# EAGLE schematic carte suiveur (EAGLE 5.12)
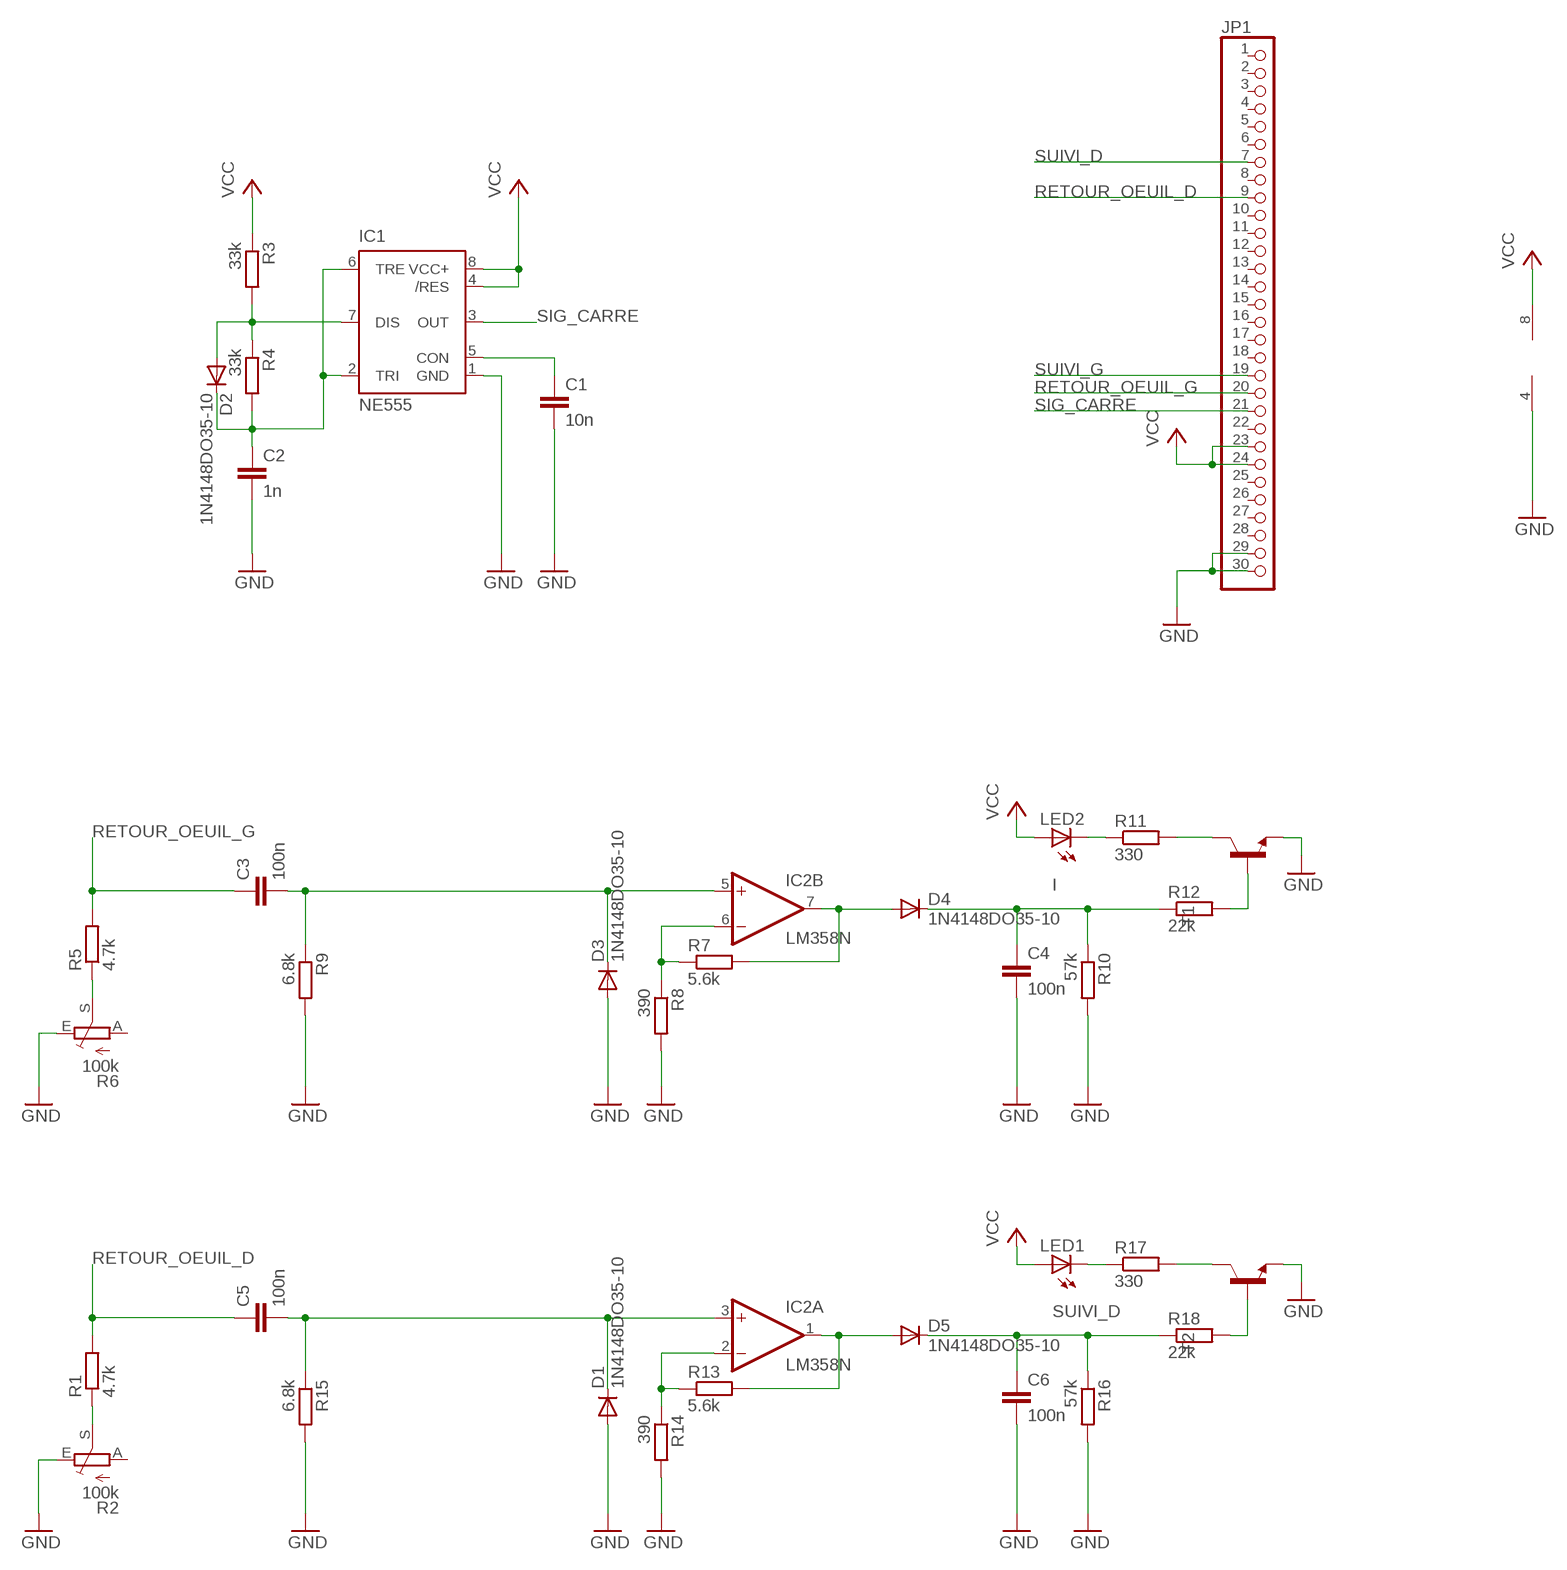
[diagram p0: schematic, sheet 1]

## Parts
C1  10n  C-EU050-025X075  [C050-025X075]
C2  1n  C-EU102-043X133  [C102-043X133]
C3  100n  C-EU050-025X075  [C050-025X075]
C4  100n  C-EU050-025X075  [C050-025X075]
C5  100n  C-EU050-025X075  [C050-025X075]
C6  100n  C-EU050-025X075  [C050-025X075]
D1  1N4148DO35-10  [DO35-10]
D2  1N4148DO35-10  [DO35-10]
D3  1N4148DO35-10  [DO35-10]
D4  1N4148DO35-10  [DO35-10]
D5  1N4148DO35-10  [DO35-10]
IC1  NE555  [DIL-08]
IC2  LM358N  [DIL08]
JP1  PINHD-1X30  [1X30]
LED1  LED3MM  [LED3MM]
LED2  LED3MM  [LED3MM]
R1  4.7k  R-EU_0207/10  [0207/10]
R2  100k  TRIM_EU-CA9V  [CA9V]
R3  33k  R-EU_0207/10  [0207/10]
R4  33k  R-EU_0207/10  [0207/10]
R5  4.7k  R-EU_0207/10  [0207/10]
R6  100k  TRIM_EU-CA9V  [CA9V]
R7  5.6k  R-EU_0207/10  [0207/10]
R8  390  R-EU_0207/12  [0207/12]
R9  6.8k  R-EU_0207/10  [0207/10]
R10  57k  R-EU_0207/10  [0207/10]
R11  330  R-EU_0207/10  [0207/10]
R12  22k  R-EU_0207/10  [0207/10]
R13  5.6k  R-EU_0207/10  [0207/10]
R14  390  R-EU_0207/10  [0207/10]
R15  6.8k  R-EU_0207/10  [0207/10]
R16  57k  R-EU_0207/10  [0207/10]
R17  330  R-EU_0207/10  [0207/10]
R18  22k  R-EU_0207/10  [0207/10]
T1  2N2222-NPN-TO92-EBC  [TO92-EBC]
T2  2N2222-NPN-TO92-EBC  [TO92-EBC]

## Nets
GND: C1.2 C2.2 C4.2 C6.2 D1.A D3.A IC1.1(GND) IC2.4(P:V-) JP1.29 JP1.30 R2.E R6.E R8.2 R9.2 R10.2 R14.2 R15.2 R16.2 T1.E T2.E
I: C4.1 D4.C R10.1 R12.1
N$1: LED1.K(C) R17.1
N$2: D2.A IC1.7(DIS) R3.2 R4.1
N$3: C2.1 D2.C IC1.2(TRI) IC1.6(TRE) R4.2
N$4: C1.1 IC1.5(CON)
N$5: C5.2 D1.C IC2.3(A:+IN) R15.1
N$6: IC2.2(A:-IN) R13.1 R14.1
N$7: C3.2 D3.C IC2.5(B:+IN) R9.1
N$8: IC2.6(B:-IN) R7.1 R8.1
N$9: D4.A IC2.7(B:OUT) R7.2
N$10: R5.1 R6.S
N$12: D5.A IC2.1(A:OUT) R13.2
N$13: R1.1 R2.S
N$14: R11.2 T1.C
N$16: R17.2 T2.C
N$17: LED2.K(C) R11.1
N$18: R18.2 T2.B
N$19: R12.2 T1.B
RETOUR_OEUIL_D: C5.1 JP1.9 R1.2
RETOUR_OEUIL_G: C3.1 JP1.20 R5.2
SIG_CARRE: IC1.3(OUT) JP1.21
SUIVI_D: C6.1 D5.C JP1.7 R16.1 R18.1
SUIVI_G: JP1.19
VCC: IC1.4(/RES) IC1.8(VCC+) IC2.8(P:V+) JP1.23 JP1.24 LED1.A LED2.A R3.1
Unconnected: JP1.1 JP1.2 JP1.3 JP1.4 JP1.5 JP1.6 JP1.8 JP1.10 JP1.11 JP1.12 JP1.13 JP1.14 JP1.15 JP1.16 JP1.17 JP1.18 JP1.22 JP1.25 JP1.26 JP1.27 JP1.28 R2.A R6.A

## Library data of the parts
C1-C6 = resistor:C-EU: CAPACITOR, European symbol
D1-D5 = diode:1N4148: DIODE high speed (Philips)
IC1 = st-microelectronics:NE555: General purpose bipolar Timer; MF: Arrow Electronics; MPN: NE555N; OC_FARNELL: 1467742; OC_NEWARK: 89K1486
IC2 = linear:LM358: OP AMP also LM158; LM258; LM2904 Source: http://cache.national.com/ds/LM/LM158.pdf
JP1 = pinhead:PINHD-1X30: PIN HEADER
LED1 LED2 = led:LED: LED OSRAM: - CHIPLED LG R971, LG N971, LY N971, LG Q971, LY Q971, LO R971, LY R971 LH N974, LH R974 LS Q976, LO Q976, LY Q976 LO Q996 - Hyper CHIPLED LW Q18S LB Q993, LB Q99A, LB R99A - SideLED LS A670, LO A670, LY A670, LG A670, LP A670 LB A673, LV A673, LT A673, LW A673 LH A674 LY A675 LS A676, LA A676, LO A676, LY A676, LW A676 LS A679, LY A679, LG A679 - Hyper Micro SIDELED® LS Y876, LA Y876, LO Y876, LY Y876 LT Y87S - SmartLED LW L88C, LW L88S LB L89C, LB L89S, LG L890 LS L89K, LO L89K, LY L89K LS L896, LA L896, LO L896, LY L896 - TOPLED LS T670, LO T670, LY T670, LG T670, LP T670 LSG T670, LSP T670, LSY T670, LOP T670, LYG T670 LG T671, LOG T671, LSG T671 LB T673, LV T673, LT T673, LW T673 LH T674 LS T676, LA T676, LO T676, LY T676, LB T676, LH T676, LSB T676, LW T676 LB T67C, LV T67C, LT T67C, LS T67K, LO T67K, LY T67K, LW E67C LS E67B, LA E67B, LO E67B, LY E67B, LB E67C, LV E67C, LT E67C LW T67C LS T679, LY T679, LG T679 LS T770, LO T770, LY T770, LG T770, LP T770 LB T773, LV T773, LT T773, LW T773 LH T774 LS E675, LA E675, LY E675, LS T675 LS T776, LA T776, LO T776, LY T776, LB T776 LHGB T686 LT T68C, LB T68C - Hyper Mini TOPLED® LB M676 - Mini TOPLED Santana® LG M470 LS M47K, LO M47K, LY M47K Source: http://www.osram.convergy.de LUXEON: - LUMILED® LXK2-PW12-R00, LXK2-PW12-S00, LXK2-PW14-U00, LXK2-PW14-V00 LXK2-PM12-R00, LXK2-PM12-S00, LXK2-PM14-U00 LXK2-PE12-Q00, LXK2-PE12-R00, LXK2-PE12-S00, LXK2-PE14-T00, LXK2-PE14-U00 LXK2-PB12-K00, LXK2-PB12-L00, LXK2-PB12-M00, LXK2-PB14-N00, LXK2-PB14-P00, LXK2-PB14-Q00 LXK2-PR12-L00, LXK2-PR12-M00, LXK2-PR14-Q00, LXK2-PR14-R00 LXK2-PD12-Q00, LXK2-PD12-R00, LXK2-PD12-S00 LXK2-PH12-R00, LXK2-PH12-S00 LXK2-PL12-P00, LXK2-PL12-Q00, LXK2-PL12-R00 Source: www.luxeon.com KINGBRIGHT: KA-3528ASYC Source: www.kingbright.com
R1 R3-R5 R7-R18 = resistor:R-EU_: RESISTOR, European symbol
R2 R6 = pot:TRIM_EU-: POTENTIOMETER
T1 T2 = transistor-neu-to92:*-NPN-: NPN Transistror